# EAGLE design mcu_board (EAGLE 7.5.0)
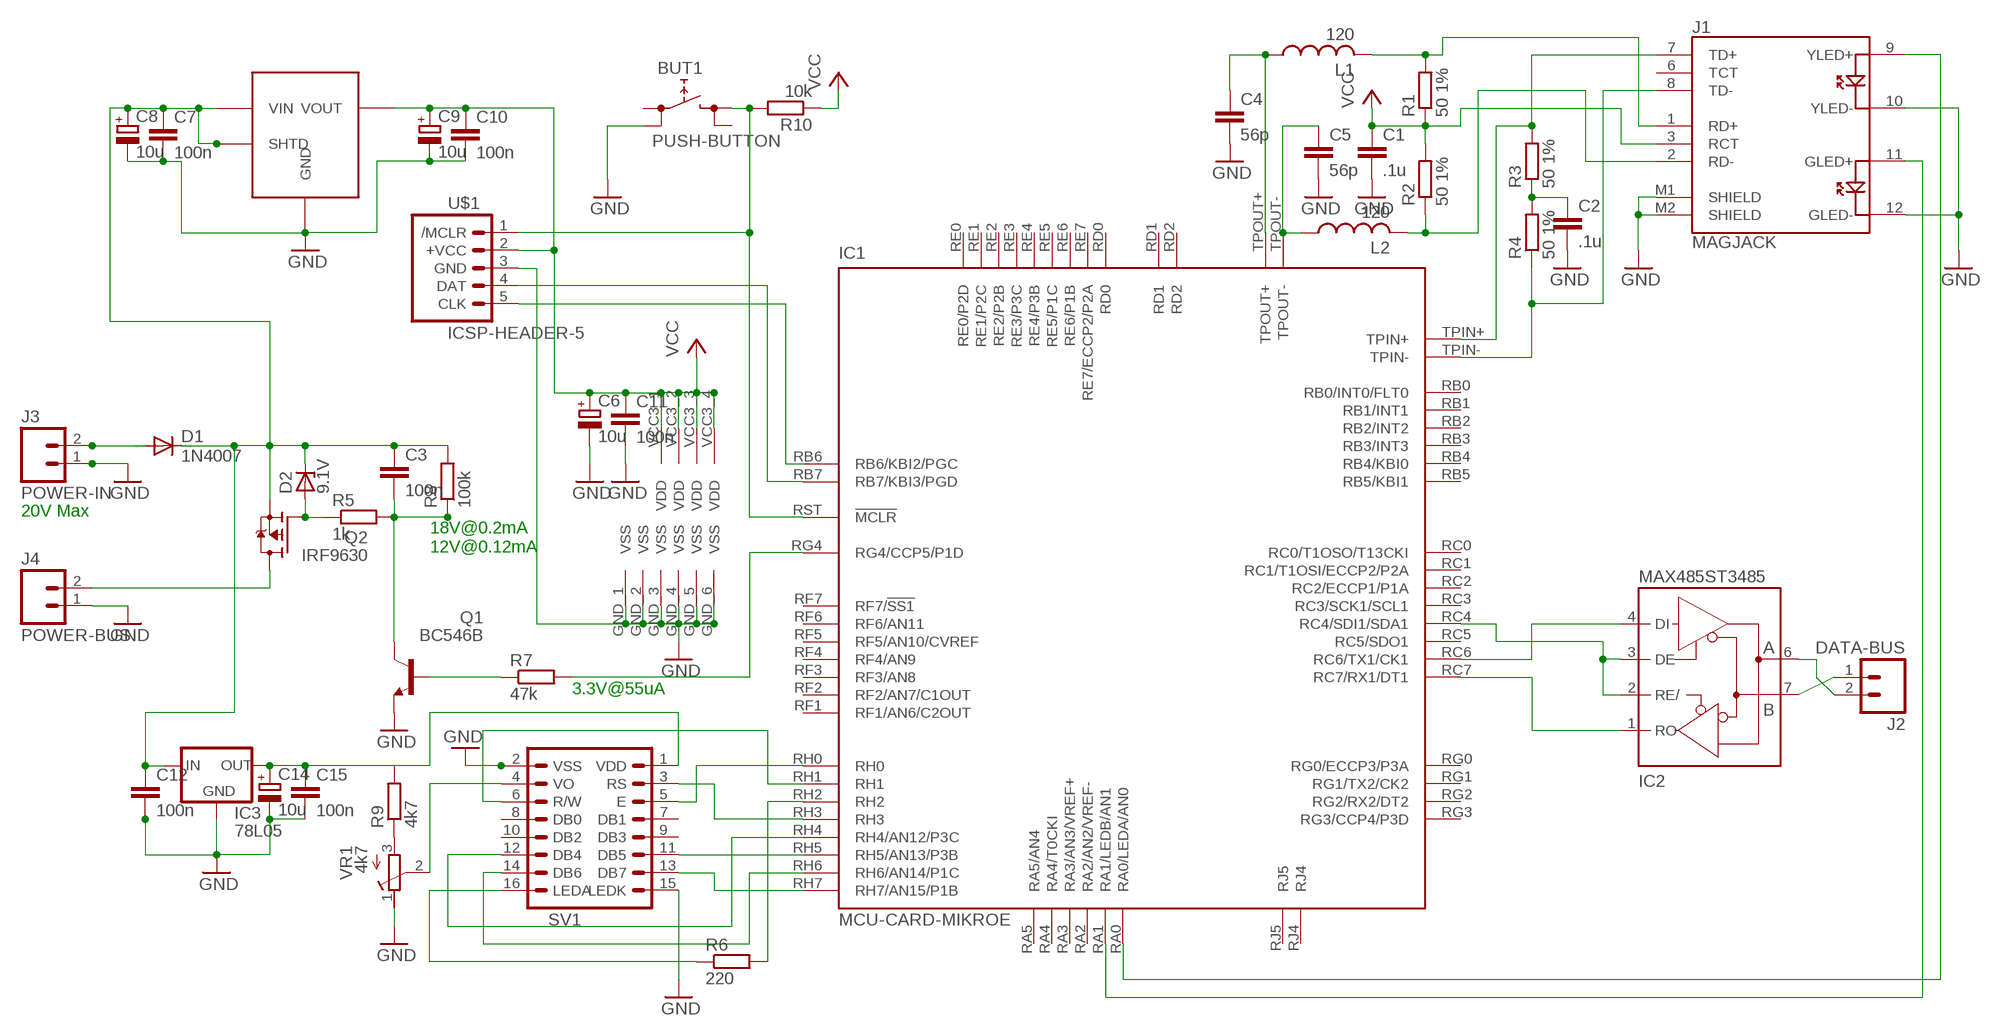
[diagram p0: schematic, sheet 1]

## Parts
BUT1  PUSH-BUTTON  [MICRO-SWITCH]
C1  .1u  C-EU050-025X075  [C050-025X075]
C2  .1u  C-EU050-025X075  [C050-025X075]
C3  100n  C-EU050-025X075  [C050-025X075]
C4  56p  C-EUC0805  [C0805]
C5  56p  C-EUC0805  [C0805]
C6  10u  CPOL-EUE2.5-6  [E2,5-6]
C7  100n  C-EU050-025X075  [C050-025X075]
C8  10u  CPOL-EUE2.5-7  [E2,5-7]
C9  10u  CPOL-EUE2.5-7  [E2,5-7]
C10  100n  C-EU050-025X075  [C050-025X075]
C11  100n  C-EU050-025X075  [C050-025X075]
C12  100n  C-EU050-025X075  [C050-025X075]
C14  10u  CPOL-EUE2.5-7  [E2,5-7]
C15  100n  C-EU050-025X075  [C050-025X075]
D1  1N4007  [DO41-10]
D2  9.1V  ZENERD5  [D-5]
IC1  MCU-CARD-MIKROE  [LV18F]
IC2  MAX485ST3485  [SO08]
IC3  78L05  78LXX  [78LXX]
J1  MAGJACK  [MAGJACK]
J2  DATA-BUS  M02-SCREW-3.5MM3.5MM  [SCREWTERMINAL-3.5MM-2]
J3  POWER-IN  M02-SCREW-3.5MM3.5MM  [SCREWTERMINAL-3.5MM-2]
J4  POWER-BUS  M02-SCREW-3.5MM3.5MM  [SCREWTERMINAL-3.5MM-2]
L1  120  L-US  [R0603]
L2  120  L-US  [R0603]
Q1  BC546B  [TO92-]
Q2  IRF9630  [TO220V]
R1  50 1%  R-EU_0207/10  [0207/10]
R2  50 1%  R-EU_0207/10  [0207/10]
R3  50 1%  R-EU_0207/10  [0207/10]
R4  50 1%  R-EU_0207/10  [0207/10]
R5  1k  R-EU_0207/10  [0207/10]
R6  220  R-EU_0207/10  [0207/10]
R7  47k  R-EU_0207/10  [0207/10]
R8  100k  R-EU_0207/10  [0207/10]
R9  4k7  R-EU_0207/10  [0207/10]
R10  10k  R-EU_0207/10  [0207/10]
SV1  WM-C2002M-DISP  [MA08-2]
U$1  ICSP-HEADER-5  [1X05]
U$3  POLOLU-2098  [POLOLU-10-13]
VR1  4k7  TRIMMER  [V_TRIMMER]

## Nets
485_A: IC2.6(A) J2.2
485_B: IC2.7(B) J2.1
GND: BUT1.2 C1.2 C2.2 C4.2 C5.2 C6.- C7.2 C8.- C9.- C10.2 C11.2 C12.2 C14.- C15.2 IC1.GND_1(VSS) IC1.GND_2(VSS) IC1.GND_3(VSS) IC1.GND_4(VSS) IC1.GND_5(VSS) IC1.GND_6(VSS) IC3.GND J1.10(YLED-) J1.12(GLED-) J1.M1(SHIELD) J1.M2(SHIELD) J3.1 J4.1 Q1.1(E) SV1.2(VSS) SV1.15(LEDK) U$1.3(GND) U$3.P$3(GND) VR1.1(A)
N$1: C4.1 IC1.TPOUT+ L1.1
N$2: C2.1 R3.1 R4.2
N$3: J1.1(RD+) L1.2 R1.2
N$4: J1.2(RD-) L2.2 R2.1
N$5: IC1.TPIN+ J1.7(TD+) R3.2
N$6: IC1.TPIN- J1.8(TD-) R4.1
N$7: C5.1 IC1.TPOUT- L2.1
N$8: IC1.RC7(RC7/RX1/DT1) IC2.1(RO)
N$9: IC1.RA0(RA0/LEDA/AN0) J1.9(YLED+)
N$10: IC1.RA1(RA1/LEDB/AN1) J1.11(GLED+)
N$11: IC1.RC6(RC6/TX1/CK1) IC2.4(DI)
N$12: IC1.RC4(RC4/SDI1/SDA1) IC2.2(RE/) IC2.3(DE)
N$13: BUT1.3 IC1.RST(!MCLR) R10.2 U$1.1(/MCLR)
N$14: IC1.RB6(RB6/KBI2/PGC) U$1.5(CLK)
N$15: IC1.RB7(RB7/KBI3/PGD) U$1.4(DAT)
N$16: IC1.RH0 SV1.5(E)
N$17: IC1.RH1 SV1.6(R/W)
N$19: IC1.RH3 SV1.3(RS)
N$20: IC1.RH4(RH4/AN12/P3C) SV1.12(DB4)
N$21: IC1.RH5(RH5/AN13/P3B) SV1.11(DB5)
N$22: IC1.RH6(RH6/AN14/P1C) SV1.14(DB6)
N$23: IC1.RH7(RH7/AN15/P1B) SV1.13(DB7)
N$25: D1.A J3.2
N$26: SV1.4(VO) VR1.2(S)
N$27: J4.2 Q2.2(D)
N$28: IC1.RG4(RG4/CCP5/P1D) R7.2
N$29: D2.A Q2.1(G) R5.1
N$30: R6.1 SV1.16(LEDA)
N$31: IC1.RH2 R6.2
N$32: C3.2 Q1.3(C) R5.2 R8.1
N$33: Q1.2(B) R7.1
N$34: R9.1 VR1.3(E)
VCC: C1.1 C6.+ C9.+ C10.1 C11.1 IC1.VCC3_1(VDD) IC1.VCC3_2(VDD) IC1.VCC3_3(VDD) IC1.VCC3_4(VDD) J1.3(RCT) R1.1 R2.2 R10.1 U$1.2(+VCC) U$3.P$4(VOUT)
VCC5: C14.+ C15.1 IC3.OUT R9.2 SV1.1(VDD)
VIN: C3.1 C7.1 C8.+ C12.1 D1.C D2.C IC3.IN Q2.3(S) R8.2 U$3.P$1(SHTD) U$3.P$2(VIN)
Unconnected: BUT1.1 BUT1.4 IC1.RA2(RA2/AN2/VREF-) IC1.RA3(RA3/AN3/VREF+) IC1.RA4(RA4/T0CKI) IC1.RA5(RA5/AN4) IC1.RB0(RB0/INT0/FLT0) IC1.RB1(RB1/INT1) IC1.RB2(RB2/INT2) IC1.RB3(RB3/INT3) IC1.RB4(RB4/KBI0) IC1.RB5(RB5/KBI1) IC1.RC0(RC0/T1OSO/T13CKI) IC1.RC1(RC1/T1OSI/ECCP2/P2A) IC1.RC2(RC2/ECCP1/P1A) IC1.RC3(RC3/SCK1/SCL1) IC1.RC5(RC5/SDO1) IC1.RD0 IC1.RD1 IC1.RD2 IC1.RE0(RE0/P2D) IC1.RE1(RE1/P2C) IC1.RE2(RE2/P2B) IC1.RE3(RE3/P3C) IC1.RE4(RE4/P3B) IC1.RE5(RE5/P1C) IC1.RE6(RE6/P1B) IC1.RE7(RE7/ECCP2/P2A) IC1.RF1(RF1/AN6/C2OUT) IC1.RF2(RF2/AN7/C1OUT) IC1.RF3(RF3/AN8) IC1.RF4(RF4/AN9) IC1.RF5(RF5/AN10/CVREF) IC1.RF6(RF6/AN11) IC1.RF7(RF7/!SS1) IC1.RG0(RG0/ECCP3/P3A) IC1.RG1(RG1/TX2/CK2) IC1.RG2(RG2/RX2/DT2) IC1.RG3(RG3/CCP4/P3D) IC1.RJ4 IC1.RJ5 J1.6(TCT) SV1.7(DB1) SV1.8(DB0) SV1.9(DB3) SV1.10(DB2)

## Notes on the sheet
- 20V Max
- 18V@0.2mA
  12V@0.12mA
- 3.3V@55uA

## Power pins joined to a net without a drawn wire
GND: IC2.5(GND)
VCC: IC2.8(VCC)

## Library data of the parts
BUT1 = custom:PUSH-BUTTON
C1-C5 C7 C10-C12 C15 = custom:C-EU: CAPACITOR, European symbol
C6 C8 C9 C14 = custom:CPOL-EU: POLARIZED CAPACITOR, European symbol
D1 = custom:1N4007: DIODE general purpose rectifier, 1 A
D2 = custom:ZENER
IC1 = custom:MCU-CARD-MIKROE: PIC18F87J60 on MCU CARD
IC2 = custom:MAX485: RS485 TRANSEIVER
IC3 = custom:78LXX: VOLTAGE REGULATOR
J1 = custom:MAGJACK: RJ-45 with LEDs
J2-J4 = custom:M02-SCREW-3.5MM: Standard 2-pin 0.1" header. Use with - straight break away headers ( PRT-00116) - right angle break away headers (PRT-00553) - swiss pins (PRT-00743) - machine pins (PRT-00117) - female headers (PRT-00115) Molex polarized connector foot print use with: PRT-08233 with associated crimp pins and housings. 2.54_SCREWTERM for use with PRT-10571. 3.5mm Screw Terminal footprints for PRT-08084 5mm Screw Terminal footprints for use with PRT-08432; PROD_ID: CONN-08399
L1 L2 = custom:L-US: INDUCTOR, American symbol
Q1 = custom:BC546B: NPN Transistor
Q2 = custom:IRF9630
R1-R10 = custom:R-EU_: RESISTOR, European symbol
SV1 = custom:WM-C2002M-DISP: PIN HEADER
U$1 = custom:ICSP-HEADER-5
U$3 = custom:POLOLU-2098: 5V Regulator - Max in 42V
VR1 = custom:TRIMMER

## Board
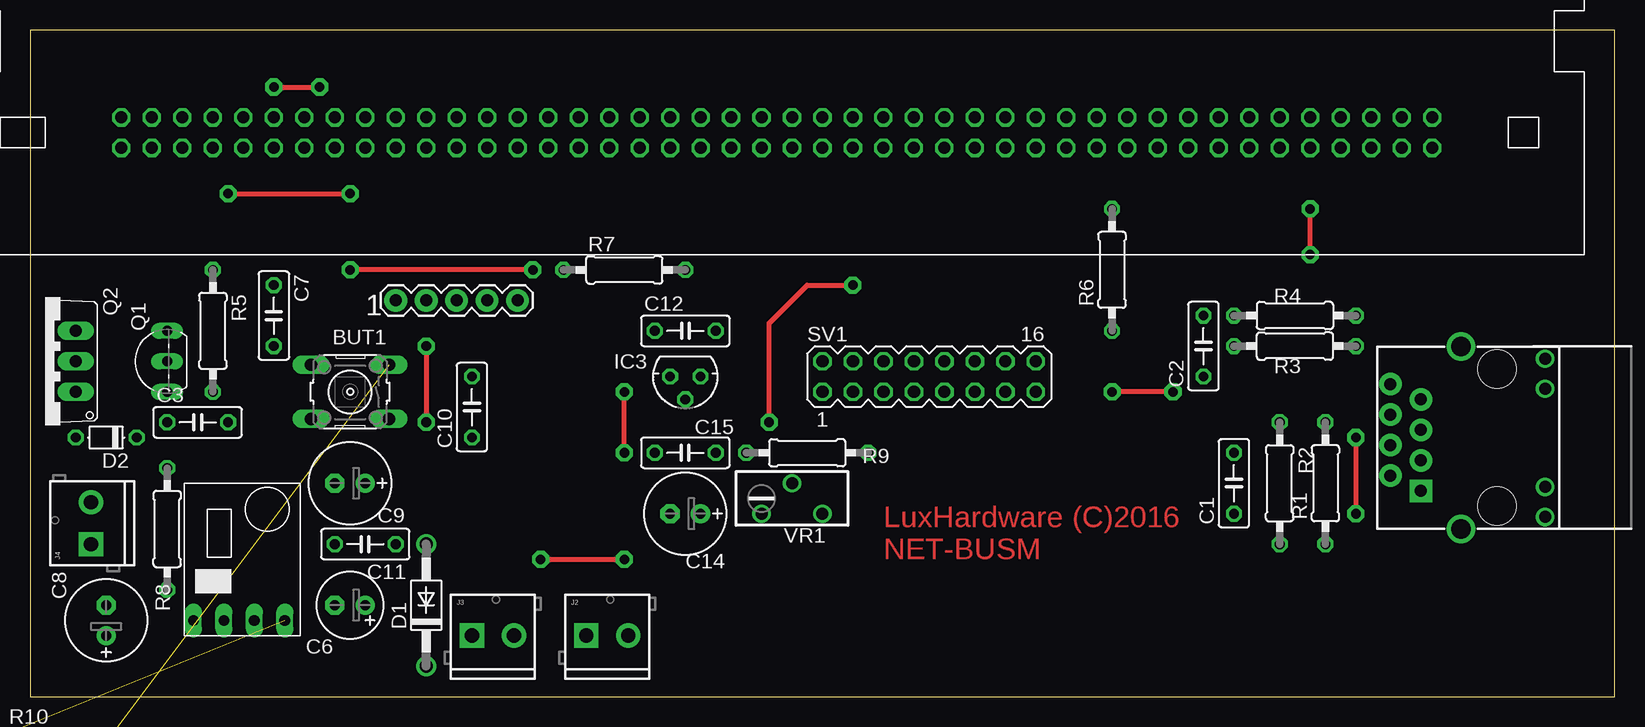
[diagram p1: board, top side]
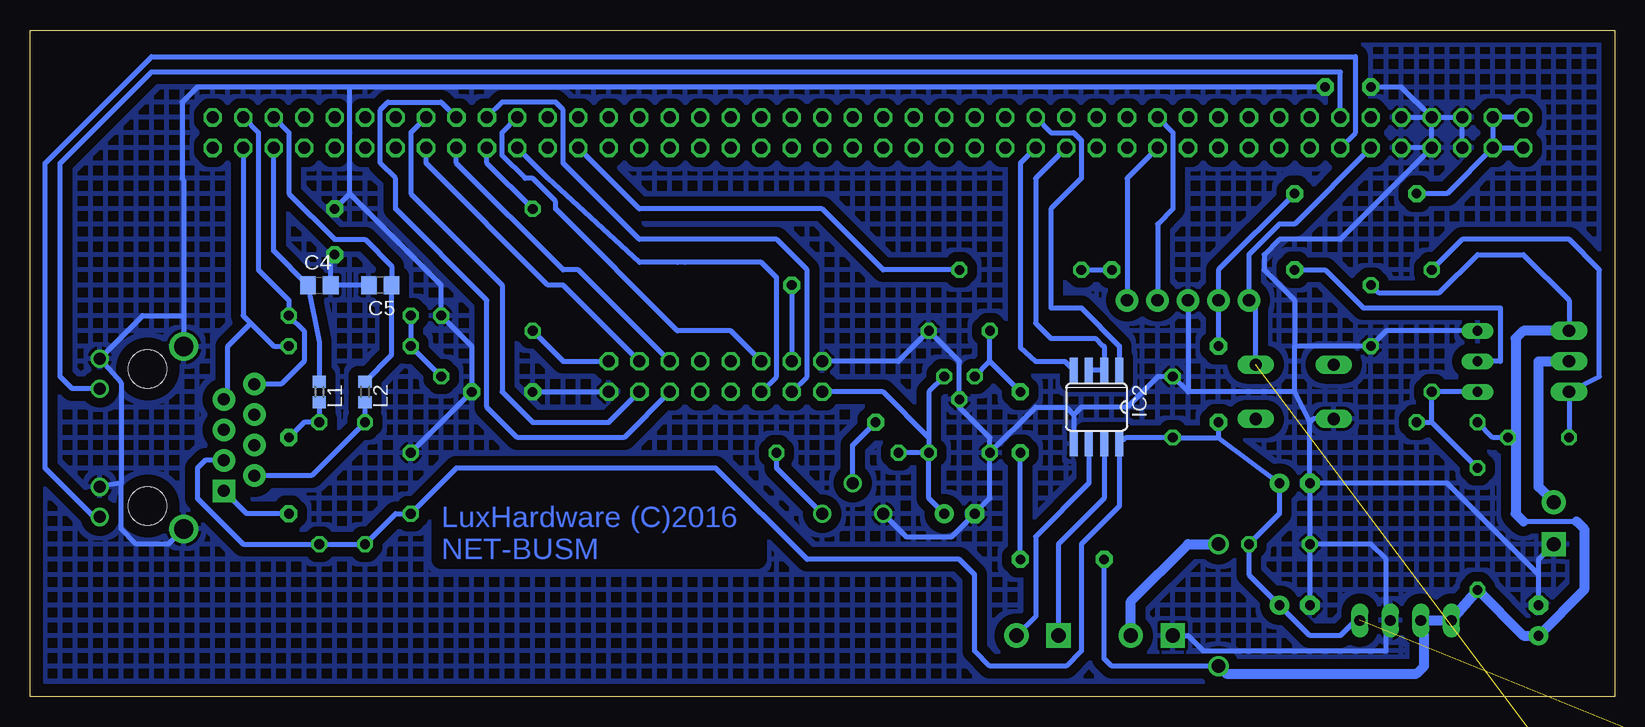
[diagram p2: board, bottom side, seen from below]

Size 132.06 x 55.55 mm. Coordinates in mm from the lower left corner, seen from the top.
Outline: 0,0 132.06,0 132.06,55.55 0,55.55 0,0
Copper layers (1*16): Top 0.035mm / dielectric 1.5mm / Bottom 0.035mm
Design rules "default": minimum track width 10mil, minimum drill 24mil, track to track 8mil, track to pad 8mil, pad to pad 8mil, via to via 8mil, smd to smd 8mil, copper to edge 40mil, drill to drill 8mil, minimum pad ring 10mil, minimum via ring 8mil, stop-mask expansion 4mil, vias tented up to drill 0mil, thermal gap 10mil

### Footprints (pad centres in the part's own frame; a part is rotated, then mirrored left to right if it is on the bottom)
MICRO-SWITCH = drill 1.016 long: 1 -3.251,2.261; 2 3.251,2.261; 3 -3.251,-2.261; 4 3.251,-2.261
C050-025X075 = drill 0.813 octagon: 1 -2.54,0; 2 2.54,0
C0805 = smd 1.3 x 1.5: 1 -0.95,0; 2 0.95,0
E2,5-6 = drill 0.813 pad 1.6: + -1.27,0 | drill 0.813 pad 1.6 octagon: - 1.27,0
E2,5-7 = drill 0.813 pad 1.6: + -1.27,0 | drill 0.813 pad 1.6 octagon: - 1.27,0
DO41-10 = drill 1.118: A 5.08,0; C -5.08,0
D-5 = drill 0.813 octagon: A 2.54,0; C -2.54,0
LV18F = drill 1 octagon: GND_1 5.08,0; GND_2 7.62,0; GND_3 10.16,0; GND_4 5.08,2.54; GND_5 7.62,2.54; GND_6 10.16,2.54; NC 12.7,2.54; NC_2 45.72,2.54; NC_3 48.26,0; NC_4 48.26,2.54; NC_5 50.8,0; NC_6 50.8,2.54; NC_7 63.5,0; NC_8 78.74,2.54; NC_9 81.28,0; NC_10 81.28,2.54; P$1 109.22,0; P$2 109.22,2.54; P$75 93.98,0; P$76 93.98,2.54; P$77 96.52,0; P$78 96.52,2.54; P$81 101.6,0; P$82 101.6,2.54; RA0 15.24,0; RA1 15.24,2.54; RA2 17.78,0; RA3 17.78,2.54; RA4 20.32,0; RA5 20.32,2.54; RB0 22.86,0; RB1 22.86,2.54; RB2 25.4,0; RB3 25.4,2.54; RB4 27.94,0; RB5 27.94,2.54; RB6 30.48,0; RB7 30.48,2.54; RC0 33.02,0; RC1 33.02,2.54; RC2 35.56,0; RC3 35.56,2.54; RC4 38.1,0; RC5 38.1,2.54; RC6 40.64,0; RC7 40.64,2.54; RD0 43.18,0; RD1 43.18,2.54; RD2 45.72,0; RE0 53.34,0; RE1 53.34,2.54; RE2 55.88,0; RE3 55.88,2.54; RE4 58.42,0; RE5 58.42,2.54; RE6 60.96,0; RE7 60.96,2.54; RF1 63.5,2.54; RF2 66.04,0; RF3 66.04,2.54; RF4 68.58,0; RF5 68.58,2.54; RF6 71.12,0; RF7 71.12,2.54; RG0 73.66,0; RG1 73.66,2.54; RG2 76.2,0; RG3 76.2,2.54; RG4 78.74,0; RH0 83.82,0; RH1 83.82,2.54; RH2 86.36,0; RH3 86.36,2.54; RH4 88.9,0; RH5 88.9,2.54; RH6 91.44,0; RH7 91.44,2.54; RJ4 99.06,0; RJ5 99.06,2.54; RST 12.7,0; TPIN+ 106.68,0; TPIN- 106.68,2.54; TPOUT+ 104.14,0; TPOUT- 104.14,2.54; VCC3_1 0,0; VCC3_2 2.54,0; VCC3_3 0,2.54; VCC3_4 2.54,2.54
SO08 = smd 0.66 x 2.032: 1 -1.905,-3.073; 2 -0.635,-3.073; 3 0.635,-3.073; 4 1.905,-3.073; 5 1.905,3.073; 6 0.635,3.073; 7 -0.635,3.073; 8 -1.905,3.073
78LXX = drill 0.813 octagon: GND 0,1.905; IN 1.27,0; OUT -1.27,0
MAGJACK = drill 1 pad 1.88 square: 1 3.175,17.445 | drill 1 pad 1.88: 2 4.445,19.985; 3 5.715,17.445; 4 6.985,19.985; 5 8.255,17.445; 6 9.525,19.985; 7 10.795,17.445; 8 12.065,19.985 | drill 1 pad 1.27: 9 1,7.1; 10 3.5,7.1; 11 11.7,7.1; 12 14.2,7.1 | drill 1.6 pad 2.184: M1 0,14.1; M2 15.2,14.1 | hole 3.2: 1.905,11.095; 13.335,11.095
SCREWTERMINAL-3.5MM-2 = drill 1.2 pad 2.032 square: 1 0,0 | drill 1.2 pad 2.032: 2 3.5,0
R0603 = smd 1 x 1.1: 1 -0.85,0; 2 0.85,0
TO92- = drill 0.813 long: 1 2.54,0; 2 0,0; 3 -2.54,0
TO220V = drill 1.016 long: 1 -2.54,-2.54; 2 0,-2.54; 3 2.54,-2.54
0207/10 = drill 0.813 octagon: 1 -5.08,0; 2 5.08,0
MA08-2 = drill 1.016 octagon: 1 -8.89,-1.27; 2 -8.89,1.27; 3 -6.35,-1.27; 4 -6.35,1.27; 5 -3.81,-1.27; 6 -3.81,1.27; 7 -1.27,-1.27; 8 -1.27,1.27; 9 1.27,-1.27; 10 1.27,1.27; 11 3.81,-1.27; 12 3.81,1.27; 13 6.35,-1.27; 14 6.35,1.27; 15 8.89,-1.27; 16 8.89,1.27
1X05 = drill 1.016 pad 1.88: 1 0,0; 2 2.54,0; 3 5.08,0; 4 7.62,0; 5 10.16,0
POLOLU-10-13 = drill 0.9 long: P$1 -4.16,-1.27; P$2 -1.62,-1.27; P$3 0.92,-1.27; P$4 3.46,-1.27
V_TRIMMER = drill 1: 1 1.27,-2.54; 2 -1.27,0; 3 1.27,2.54

### Placement (x,y rotation side)
BUT1  26.67,25.4 180 top
C1  100.33,17.78 90 top
C2  97.79,29.21 90 top
C3  13.97,22.86 0 top
C4  107.95,34.29 0 bottom
C5  102.87,34.29 180 bottom
C6  26.67,7.62 180 top
C7  20.32,31.75 270 top
C8  6.35,6.35 90 top
C9  26.67,17.78 180 top
C10  36.83,24.13 90 top
C11  27.94,12.7 180 top
C12  54.61,30.48 0 top
C14  54.61,15.24 180 top
C15  54.61,20.32 180 top
D1  33.02,7.62 90 top
D2  6.35,21.59 180 top
IC1  7.62,45.72 0 top
IC2  43.18,24.13 180 bottom
IC3  54.61,26.67 180 top
J1  133.35,13.97 90 top
J2  46.36,5.08 0 top
J3  36.83,5.08 0 top
J4  5.08,12.7 90 top
L1  107.95,25.4 270 bottom
L2  104.14,25.4 270 bottom
Q1  11.43,27.94 90 top
Q2  1.27,27.94 90 top
R1  107.95,17.78 90 top
R2  104.14,17.78 270 top
R3  105.41,29.21 0 top
R4  105.41,31.75 180 top
R5  15.24,30.48 270 top
R6  90.17,35.56 90 top
R7  49.53,35.56 0 top
R8  11.43,13.97 270 top
R9  64.77,20.32 180 top
R10  1.27,-3.81 0 top  (outside the outline)
SV1  74.93,26.67 0 top
U$1  30.48,33.02 0 top
U$3  17.78,7.62 0 top
VR1  63.5,16.51 270 top

### Tracks (layer width: path | path; a pad name or v marks a point on that pad's centre or on a via)
485_A
  Bottom 0.406: IC2.6 43.81,17.78 48.26,13.33 48.26,6.67 J2.2
485_B
  Bottom 0.406: IC2.7 42.55,16.51 46.36,12.7 J2.1
GND  (via drill 0.8 pad 1.42)
  Top 0.406: v106.68,36.83 v106.68,40.64 | v20.32,50.8 v24.13,50.8 | v95.25,25.4 v90.17,25.4
  Bottom 0.406: C5.2 C4.2 107,36.51 v106.68,36.83 | 124.46,17.78 124.46,26.15 J1.12 122.67,31.75 119.25,31.75 | 124.46,17.78 126.69,17.47 J1.10 | IC1.GND_5 17.78,50.8 v20.32,50.8 | 105.41,50.8 118.11,50.8 119.38,49.53 119.38,43.18 119.25,43.05 119.25,31.75 | 119.25,31.75 J1.M2 | 105.41,41.91 97.79,34.29 C2.2 95.25,29.21 v95.25,25.4 C1.2 | J1.M1 120.52,12.7 123.19,12.7 124.46,13.97 124.46,17.78 | IC1.GND_5 IC1.GND_4 IC1.GND_1 | IC1.GND_2 IC1.GND_5 | IC1.GND_2 22.86,38.1 27.94,38.1 29.21,36.83 29.21,35.56 26.67,33.02 26.67,29.21 | 26.67,29.21 C7.2 19.05,30.48 Q1.1 | 26.67,25.4 35.56,25.4 | U$1.3 35.56,25.4 | 35.56,25.4 C10.2 38.1,26.67 40.64,24.13 44.45,24.13 45.09,23.49 | C9.- 13.97,17.78 6.35,10.16 C8.- 6.35,11.43 J4.1 | C9.- C11.2 | C11.2 C6.- | C11.2 20.32,12.7 19.05,11.43 19.05,7.62 U$3.P$3 19.05,7.27 19.05,3.81 34.29,3.81 35.56,5.08 J3.1 | 105.41,41.91 105.41,50.8 | IC1.GND_2 IC1.GND_3 | IC1.GND_6 IC1.GND_5 | C9.- 25.4,22.86 | 25.4,22.86 26.67,25.4 | 26.67,25.4 26.67,29.21 | 45.09,23.49 IC2.5 | v106.68,40.64 105.41,41.91 | v24.13,50.8 105.41,50.8 | v90.17,25.4 SV1.15 | BUT1.2 25.12,23.14 25.4,22.86 | SV1.2 59.69,27.94 C12.2 54.61,27.94 IC3.GND 54.61,24.13 52.07,21.59 C15.2 | C15.2 52.07,16.51 C14.- 55.25,13.33 59.06,13.33 VR1.1 | C15.2 48.26,24.13 45.72,24.13 45.09,23.49
  pour Bottom (isolate 0.813, hatched): 1.27,1.27 1.27,54.61 130.81,54.61 130.81,1.27
N$1
  Bottom 0.406: L1.1 107.95,29.53 C4.1 111.76,37.15 IC1.TPOUT+
N$2
  Bottom 0.406: R4.2 R3.1 C2.1
N$3  (via drill 0.8 pad 1.42)
  Top 0.406: v110.49,21.59 v110.49,15.24
  Bottom 0.406: L1.2 R1.2 109.22,22.86 v110.49,21.59 | v110.49,15.24 114,15.24 J1.1
N$4
  Bottom 0.406: L2.2 R2.1 108.59,18.41 J1.2
N$5
  Bottom 0.406: IC1.TPIN+ 114.3,31.75 113.67,31.11 | 113.67,31.11 111.76,29.21 R3.2 | J1.7 115.57,25.1 115.57,29.21 113.67,31.11
N$6
  Bottom 0.406: IC1.TPIN- 113.03,46.99 113.03,35.56 110.49,33.02 R4.1 109.22,30.48 109.22,27.94 111.13,26.03 J1.8
N$7
  Bottom 0.406: IC1.TPOUT- 110.49,46.99 110.49,41.91 106.68,38.1 104.14,38.1 101.92,35.88 C5.1 101.92,28.47 L2.1
N$8
  Bottom 0.406: IC1.RC7 46.99,46.99 45.09,46.99 44.45,46.36 44.45,43.18 46.99,40.64 46.99,32.38 44.45,32.38 41.28,29.21 IC2.1
N$9
  Bottom 0.406: J1.9 126.73,14.97 130.81,19.05 130.81,44.45 121.92,53.34 21.59,53.34 21.59,46.99 IC1.RA0
N$10
  Bottom 0.406: J1.11 128.54,25.67 129.54,26.67 129.54,44.45 121.92,52.07 22.86,52.07 IC1.RA1
N$11
  Bottom 0.406: IC1.RC6 49.53,44.45 49.53,29.11 48.26,27.94 45.82,27.94 IC2.4
N$12
  Bottom 0.406: IC1.RC4 48.26,43.18 48.26,31.11 46.99,29.84 43.28,29.84 42.65,29.21 42.55,29.21 IC2.2 IC2.3
N$13  (1 unrouted)
  Bottom 0.406: IC1.RST 26.67,39.37 27.94,39.37 30.48,36.83 U$1.1 29.92,32.46 BUT1.3
N$14
  Bottom 0.406: IC1.RB6 40.64,43.18 U$1.5
N$15
  Bottom 0.406: IC1.RB7 36.83,46.99 36.83,40.64 38.1,39.37 U$1.4
N$16
  Bottom 0.406: IC1.RH0 88.9,43.18 81.28,36.19 78.11,36.19 77.47,36.19 71.12,36.19 69.85,34.92 69.85,26.67 SV1.5
N$17
  Bottom 0.406: SV1.6 73.66,30.48 78.11,30.48 88.27,40.64 88.27,41.27 90.17,43.18 90.81,43.18 92.71,45.08 92.71,46.99 IC1.RH1
N$19
  Bottom 0.406: IC1.RH3 92.71,49.53 88.27,49.53 87.63,48.89 87.63,44.45 81.28,38.1 69.85,38.1 67.31,35.56 67.31,26.67 SV1.3
N$20
  Bottom 0.406: SV1.12 86.36,35.56 87.63,35.56 96.52,44.45 IC1.RH4
N$21
  Bottom 0.406: SV1.11 82.55,21.59 91.44,21.59 93.98,24.13 93.98,33.02 101.6,40.64 101.6,43.18 102.87,44.45 102.87,48.89 102.23,49.53 97.79,49.53 IC1.RH5
N$22
  Bottom 0.406: SV1.14 87.63,34.29 88.9,34.29 99.06,44.45 IC1.RH6
N$23
  Bottom 0.406: IC1.RH7 100.33,46.99 100.33,41.91 92.71,34.29 92.71,25.4 90.17,22.86 83.82,22.86 SV1.13
N$25
  Bottom 0.813: J3.2 40.33,7.93 35.56,12.7 D1.A
N$26  (via drill 0.8 pad 1.42)
  Top 0.406: v61.59,22.86 61.59,31.11 64.77,34.29 v68.58,34.29
  Bottom 0.406: VR1.2 63.5,20.95 v61.59,22.86 | v68.58,34.29 SV1.4
N$27
  Bottom 0.813: J4.2 6.35,17.47 6.35,27.94 Q2.2
N$28
  Bottom 0.406: R7.2 60.96,35.56 66.04,40.64 81.28,40.64 IC1.RG4
N$29
  Bottom 0.406: R5.1 12.7,38.1 3.81,38.1 1.27,35.56 1.27,26.67 Q2.1 D2.A
N$30
  Bottom 0.406: R6.1 87.63,27.94 SV1.16
N$31
  Bottom 0.406: R6.2 93.98,44.45 IC1.RH2
N$32
  Bottom 0.406: Q1.3 R5.2 15.24,22.86 | R8.1 15.24,22.86 | C3.2 15.24,22.86
N$33  (via drill 0.8 pad 1.42)
  Top 0.406: v41.91,35.56 v26.67,35.56
  Bottom 0.406: R7.1 v41.91,35.56 | v26.67,35.56 24.13,35.56 20.96,32.38 9.52,32.38 9.52,27.94 Q1.2
N$34
  Bottom 0.406: VR1.3 69.85,19.05 R9.1
VCC  (via drill 0.8 pad 1.42)  (1 unrouted)
  Top 0.406: v33.02,29.21 v33.02,22.86 | v16.51,41.91 v26.67,41.91
  Bottom 0.406: J1.3 117.48,19.69 118.11,19.05 118.11,16.51 114.3,12.7 R1.1 R2.2 101.6,15.24 C1.1 96.52,19.05 74.93,19.05 67.31,11.43 54.61,11.43 53.34,10.16 53.34,3.81 52.07,2.54 45.72,2.54 44.45,3.81 44.45,12.7 41.28,15.88 IC2.8 40.74,21.59 C10.1 33.02,21.59 | 33.02,21.59 C9.+ 27.94,15.24 C11.1 30.48,10.16 C6.+ 25.4,5.08 22.86,5.08 21.24,6.7 U$3.P$4 | IC1.VCC3_3 IC1.VCC3_4 IC1.VCC3_2 | IC1.VCC3_2 IC1.VCC3_1 | v33.02,29.21 U$1.2 33.02,35.56 v26.67,41.91 | v33.02,22.86 33.02,21.59 | IC1.VCC3_2 13.97,41.91 v16.51,41.91
VCC5
  Bottom 0.406: 57.15,21.59 60.96,25.4 SV1.1 | IC3.OUT 57.15,25.4 57.15,21.59 | 57.15,21.59 C15.1 | C14.+ 57.15,16.51 C15.1 | C15.1 R9.2
VIN  (via drill 0.8 pad 1.42)
  Top 0.406: v42.55,11.43 v49.53,11.43 | v49.53,20.32 v49.53,25.4
  Bottom 0.406: C7.1 19.68,33.66 14.61,33.66 11.43,36.83 7.62,36.83 3.81,33.02 Q2.3 | 7.62,14.6 3.18,14.6 | C3.1 10.16,21.59 D2.C 8.25,21.59 8.25,15.24 | IC3.IN 52.07,27.94 | 52.07,27.94 C12.1 | D1.C 41.91,2.54 42.55,3.17 v42.55,11.43 | v49.53,11.43 v49.53,20.32 | v49.53,25.4 52.07,27.94
  Bottom 0.813: D1.C 32.39,1.9 16.51,1.9 15.87,2.54 15.87,5.08 U$3.P$2 U$3.P$1 R8.2 7.62,5.08 C8.+ 2.54,8.89 2.54,13.97 3.18,14.6 | Q2.3 7.62,30.48 8.25,29.84 8.25,15.24 7.62,14.6

### Text on the board
Top: LuxHardware (C)2016 / NET-BUSM
Bottom: LuxHardware (C)2016 / NET-BUSM
tPlace: 1